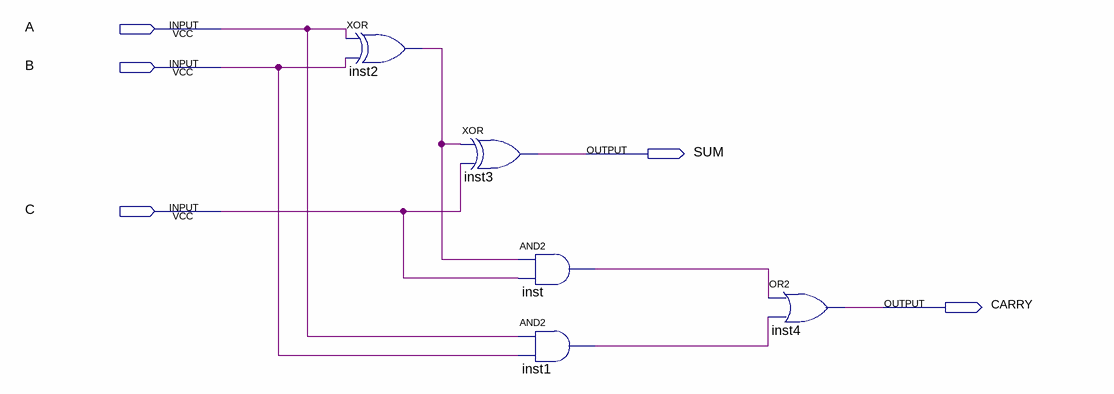
[diagram p0: schematic sheet]
// Quartus schematic Fulladder1bitNO.bdf as structural Verilog: 5 symbols, 5 pins
module Fulladder1bitNO (
  input  A,
  input  B,
  input  C,
  output SUM,
  output CARRY
);

  wire inst1_out, inst2_out, inst_out;

  xor inst2 (inst2_out, A, B);
  xor inst3 (SUM, inst2_out, C);
  and inst (inst_out, inst2_out, C);
  and inst1 (inst1_out, A, B);
  or inst4 (CARRY, inst_out, inst1_out);
endmodule
